# Altium project PinConnector2.PrjPcb
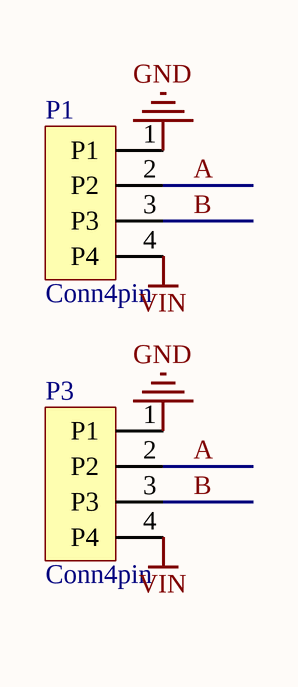
[diagram p0: PinConnector 1.2.SchDoc]
1 sheet, 2 parts. Net scope: global (net labels, ports and power ports of the same name join across sheets).
Board file: PinConnector.PcbDoc

## Sheet PinConnector 1.2.SchDoc
size A

### Parts
P1  Conn4pin  [Bourns 70AB/Female (4 conn)]
P3  Conn4pin  [Connector 4pin 75mil space]

### Nets
GND: P1.1(P1) P3.1(P1)
VIN: P1.4(P4) P3.4(P4)
A: P1.2(P2) P3.2(P2)
B: P1.3(P3) P3.3(P3)